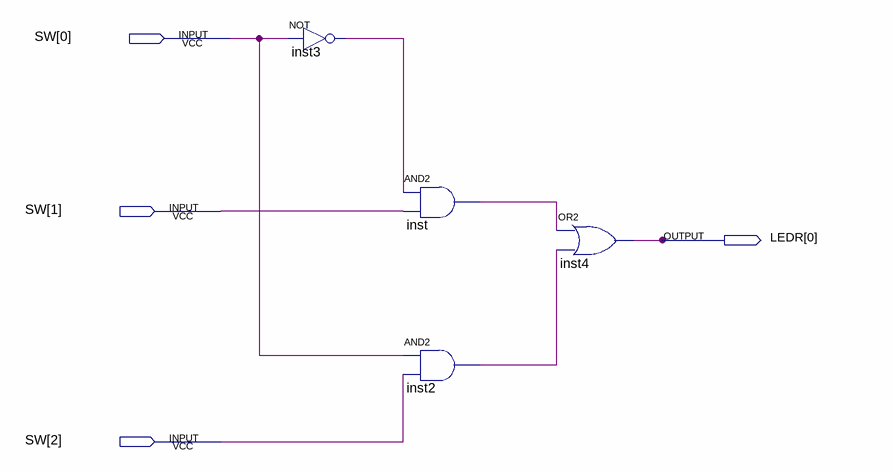
[diagram p0: schematic sheet]
// Quartus schematic lab1.bdf as structural Verilog: 4 symbols, 4 pins
module lab1 (
  input  [2:0] SW,
  output [0:0] LEDR
);

  wire inst2_out, inst3_out, inst_out;

  not inst3 (inst3_out, SW[0]);
  and inst (inst_out, inst3_out, SW[1]);
  and inst2 (inst2_out, SW[0], SW[2]);
  or inst4 (LEDR[0], inst_out, inst2_out);
endmodule
